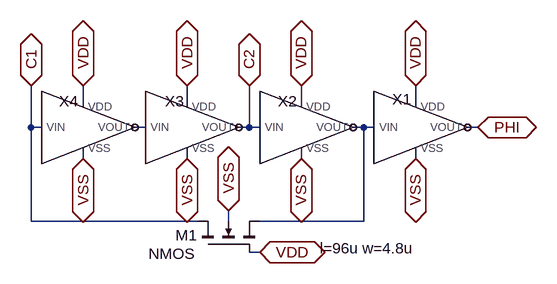
[diagram p0: schematic Master_CLK.asc]
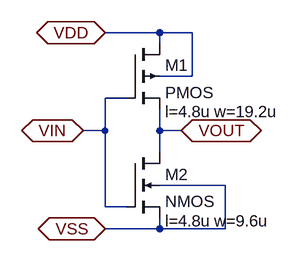
[diagram p1: sub-circuit invertor_jan20.asc]
Master_CLK.asc, the LTspice schematic file:
Version 4
SHEET 1 880 680
WIRE -112 96 -112 64
WIRE 48 96 48 64
WIRE 224 96 224 64
WIRE 400 96 400 64
WIRE -192 128 -192 64
WIRE -176 128 -192 128
WIRE -16 128 -32 128
WIRE 144 128 144 64
WIRE 144 128 128 128
WIRE 160 128 144 128
WIRE 320 128 304 128
WIRE 336 128 320 128
WIRE 496 128 480 128
WIRE -112 176 -112 160
WIRE 48 176 48 160
WIRE 224 176 224 160
WIRE 400 176 400 160
WIRE -192 272 -192 128
WIRE 64 272 -192 272
WIRE 112 272 112 256
WIRE 320 272 320 128
WIRE 320 272 160 272
WIRE 160 320 144 320
FLAG -112 64 VDD
IOPIN -112 64 BiDir
FLAG 48 64 VDD
IOPIN 48 64 BiDir
FLAG 224 64 VDD
IOPIN 224 64 BiDir
FLAG 400 64 VDD
IOPIN 400 64 BiDir
FLAG 160 320 VDD
IOPIN 160 320 BiDir
FLAG 144 64 C2
IOPIN 144 64 BiDir
FLAG -112 176 VSS
IOPIN -112 176 BiDir
FLAG 48 176 VSS
IOPIN 48 176 BiDir
FLAG 224 176 VSS
IOPIN 224 176 BiDir
FLAG 400 176 VSS
IOPIN 400 176 BiDir
FLAG -192 64 C1
IOPIN -192 64 BiDir
FLAG 496 128 PHI
IOPIN 496 128 BiDir
FLAG 112 256 VSS
IOPIN 112 256 BiDir
SYMBOL Invertor_Jan20 400 128 R0
WINDOW 0 -21 -28 Bottom 2
SYMATTR InstName X1
SYMBOL Invertor_Jan20 224 128 R0
WINDOW 0 -21 -25 Bottom 2
SYMATTR InstName X2
SYMBOL Invertor_Jan20 48 128 R0
WINDOW 0 -19 -25 Bottom 2
SYMATTR InstName X3
SYMBOL Invertor_Jan20 -112 128 R0
WINDOW 0 -22 -25 Bottom 2
SYMATTR InstName X4
SYMBOL nmos4 64 320 R270
WINDOW 123 6 189 VRight 2
WINDOW 0 26 -34 VRight 2
WINDOW 3 -2 -75 VRight 2
SYMATTR Value2 l=96u w=4.8u
SYMATTR InstName M1

invertor_jan20.asc, the sub-circuit schematic file:
Version 4
SHEET 1 880 680
WIRE 192 0 112 0
WIRE 240 0 192 0
WIRE 192 16 192 0
WIRE 240 64 240 0
WIRE 240 64 192 64
WIRE 144 96 112 96
WIRE 112 144 112 96
WIRE 112 144 80 144
WIRE 192 144 192 112
WIRE 224 144 192 144
WIRE 192 176 192 144
WIRE 288 224 192 224
WIRE 112 256 112 144
WIRE 144 256 112 256
WIRE 192 288 192 272
WIRE 192 288 112 288
WIRE 288 288 288 224
WIRE 288 288 192 288
FLAG 80 144 VIN
IOPIN 80 144 BiDir
FLAG 224 144 VOUT
IOPIN 224 144 BiDir
FLAG 112 0 VDD
IOPIN 112 0 BiDir
FLAG 112 288 VSS
IOPIN 112 288 BiDir
SYMBOL pmos4 144 16 R0
WINDOW 123 56 100 Left 2
SYMATTR Value2 l=4.8u w=19.2u
SYMATTR InstName M1
SYMBOL nmos4 144 176 R0
WINDOW 123 56 100 Left 2
SYMATTR Value2 l=4.8u w=9.6u
SYMATTR InstName M2

The netlist it stands for:
* Master_CLK.asc
XX1 VDD N002 VSS PHI invertor_jan20
XX2 VDD C2 VSS N002 invertor_jan20
XX3 VDD N001 VSS C2 invertor_jan20
XX4 VDD C1 VSS N001 invertor_jan20
M1 C1 VDD N002 VSS NMOS l=96u w=4.8u

* block symbol definitions
.subckt invertor_jan20 VDD VIN VSS VOUT
M1 VDD VIN VOUT VDD PMOS l=4.8u w=19.2u
M2 VOUT VIN VSS VSS NMOS l=4.8u w=9.6u
.ends invertor_jan20

.model NMOS NMOS
.model PMOS PMOS
.lib standard.mos
.backanno
.end